# EAGLE schematic OVMS-SimpleConsole (EAGLE 6.5.0)
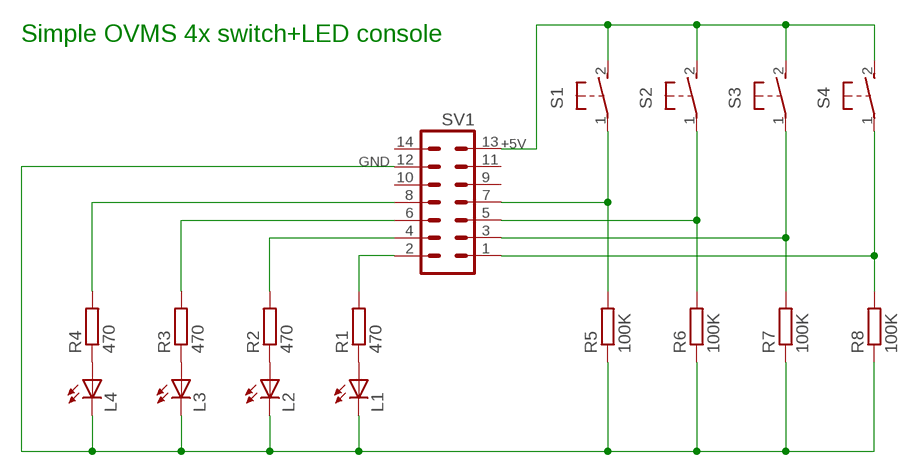
[diagram p0: schematic, sheet 1]

## Parts
L1  LED5MM  [LED5MM]
L2  LED5MM  [LED5MM]
L3  LED5MM  [LED5MM]
L4  LED5MM  [LED5MM]
R1  470  R-EU_0204/7  [0204/7]
R2  470  R-EU_0204/7  [0204/7]
R3  470  R-EU_0204/7  [0204/7]
R4  470  R-EU_0204/7  [0204/7]
R5  100K  R-EU_0204/7  [0204/7]
R6  100K  R-EU_0204/7  [0204/7]
R7  100K  R-EU_0204/7  [0204/7]
R8  100K  R-EU_0204/7  [0204/7]
S1  31-XX  [B3F-31XX]
S2  31-XX  [B3F-31XX]
S3  31-XX  [B3F-31XX]
S4  31-XX  [B3F-31XX]
SV1  14P  [14P]

## Nets
+5V: S1.2(S) S2.2(S) S3.2(S) S4.2(S) SV1.13
GND: L1.K(C) L2.K(C) L3.K(C) L4.K(C) R5.1 R6.1 R7.1 R8.1 SV1.12
N$1: R1.2 SV1.2
N$2: L1.A R1.1
N$3: L2.A R2.1
N$4: R2.2 SV1.4
N$5: L3.A R3.1
N$6: L4.A R4.1
N$7: R3.2 SV1.6
N$8: R4.2 SV1.8
N$9: R5.2 S1.1(P) SV1.7
N$10: R6.2 S2.1(P) SV1.5
N$11: R7.2 S3.1(P) SV1.3
N$12: R8.2 S4.1(P) SV1.1
Unconnected: SV1.9 SV1.10 SV1.11 SV1.14

## Notes on the sheet
- Simple OVMS 4x switch+LED console

## Library data of the parts
L1-L4 = led:LED: LED OSRAM: - CHIPLED LG R971, LG N971, LY N971, LG Q971, LY Q971, LO R971, LY R971 LH N974, LH R974 LS Q976, LO Q976, LY Q976 LO Q996 - Hyper CHIPLED LW Q18S LB Q993, LB Q99A, LB R99A - SideLED LS A670, LO A670, LY A670, LG A670, LP A670 LB A673, LV A673, LT A673, LW A673 LH A674 LY A675 LS A676, LA A676, LO A676, LY A676, LW A676 LS A679, LY A679, LG A679 - Hyper Micro SIDELED® LS Y876, LA Y876, LO Y876, LY Y876 LT Y87S - SmartLED LW L88C, LW L88S LB L89C, LB L89S, LG L890 LS L89K, LO L89K, LY L89K LS L896, LA L896, LO L896, LY L896 - TOPLED LS T670, LO T670, LY T670, LG T670, LP T670 LSG T670, LSP T670, LSY T670, LOP T670, LYG T670 LG T671, LOG T671, LSG T671 LB T673, LV T673, LT T673, LW T673 LH T674 LS T676, LA T676, LO T676, LY T676, LB T676, LH T676, LSB T676, LW T676 LB T67C, LV T67C, LT T67C, LS T67K, LO T67K, LY T67K, LW E67C LS E67B, LA E67B, LO E67B, LY E67B, LB E67C, LV E67C, LT E67C LW T67C LS T679, LY T679, LG T679 LS T770, LO T770, LY T770, LG T770, LP T770 LB T773, LV T773, LT T773, LW T773 LH T774 LS E675, LA E675, LY E675, LS T675 LS T776, LA T776, LO T776, LY T776, LB T776 LHGB T686 LT T68C, LB T68C - Hyper Mini TOPLED® LB M676 - Mini TOPLED Santana® LG M470 LS M47K, LO M47K, LY M47K Source: http://www.osram.convergy.de LUXEON: - LUMILED® LXK2-PW12-R00, LXK2-PW12-S00, LXK2-PW14-U00, LXK2-PW14-V00 LXK2-PM12-R00, LXK2-PM12-S00, LXK2-PM14-U00 LXK2-PE12-Q00, LXK2-PE12-R00, LXK2-PE12-S00, LXK2-PE14-T00, LXK2-PE14-U00 LXK2-PB12-K00, LXK2-PB12-L00, LXK2-PB12-M00, LXK2-PB14-N00, LXK2-PB14-P00, LXK2-PB14-Q00 LXK2-PR12-L00, LXK2-PR12-M00, LXK2-PR14-Q00, LXK2-PR14-R00 LXK2-PD12-Q00, LXK2-PD12-R00, LXK2-PD12-S00 LXK2-PH12-R00, LXK2-PH12-S00 LXK2-PL12-P00, LXK2-PL12-Q00, LXK2-PL12-R00 Source: www.luxeon.com KINGBRIGHT: KA-3528ASYC Source: www.kingbright.com
R1-R8 = resistor:R-EU_: RESISTOR, European symbol
S1-S4 = switch-omron:31-XX: OMRON SWITCH; MPN: B3F-3100; OC_FARNELL: 959704; OC_NEWARK: 36M3582
SV1 = con-dil:14P: DIL CABLE CONNECTOR